# Altium schematic sheet CONNECTORS2.SchDoc
size A; SheetNumber: 7; SheetTotal: 8
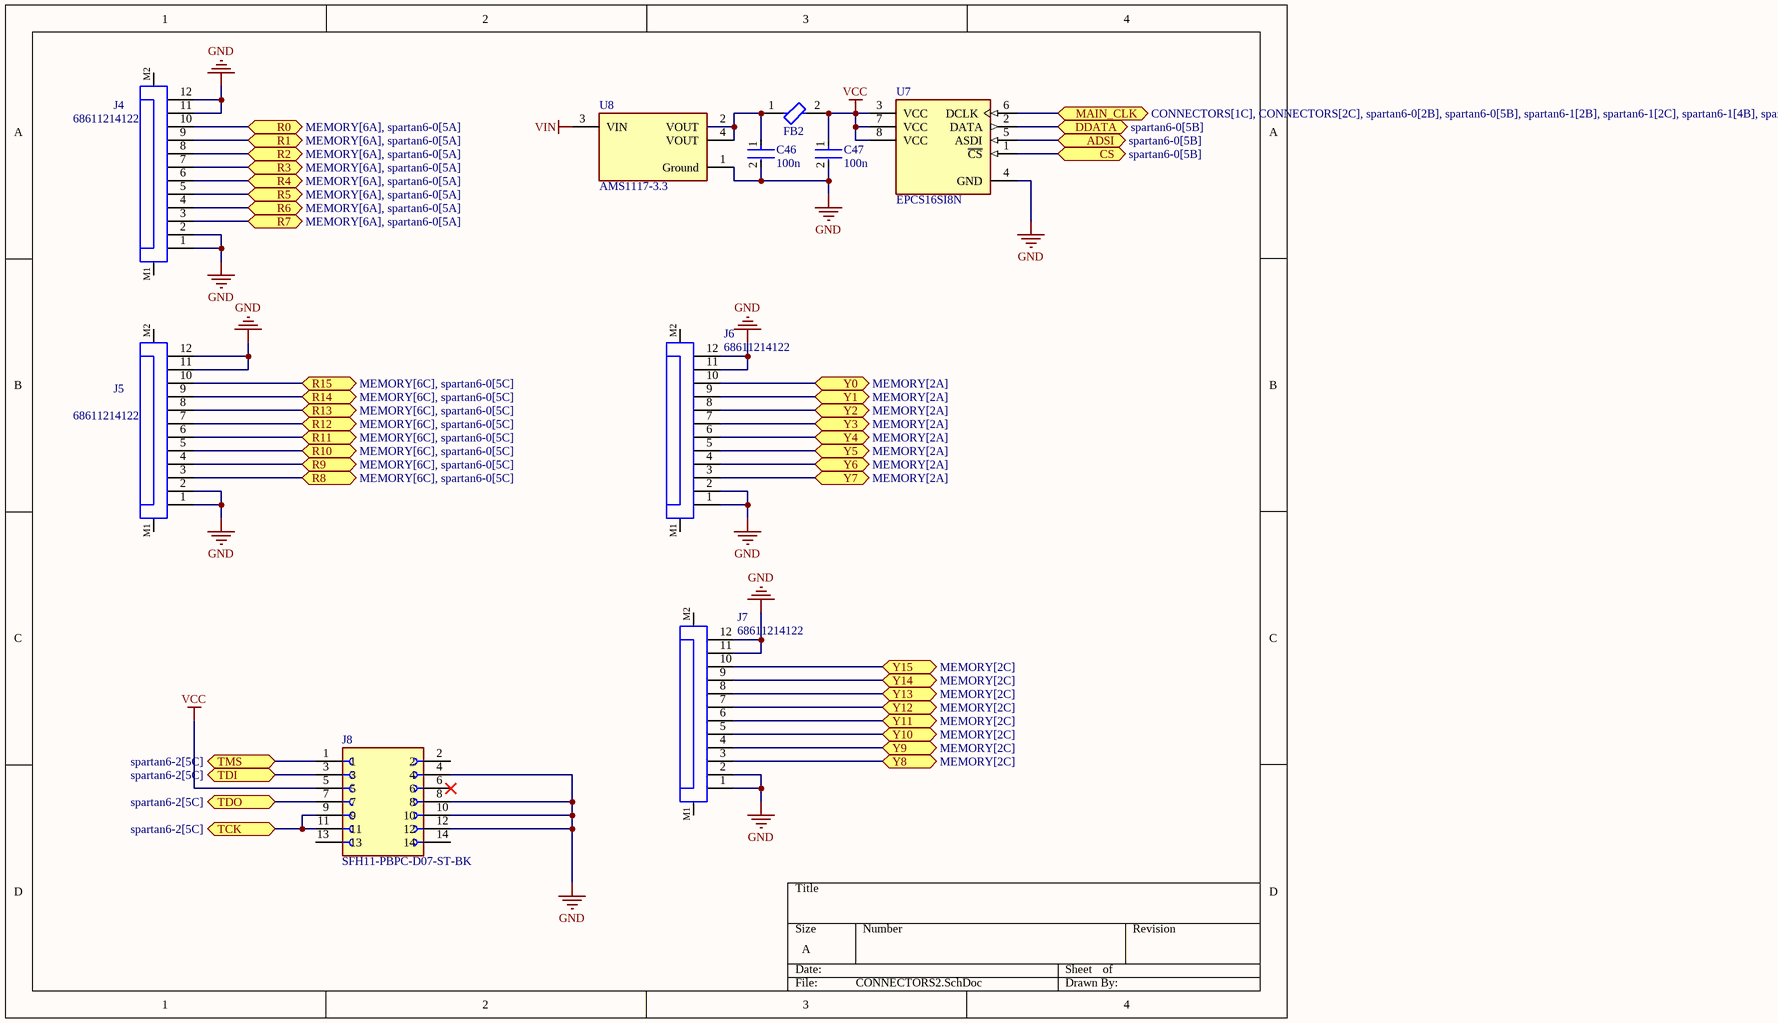
[diagram p0: CONNECTORS2.SchDoc]

## Parts
C46  100n  [FP-CL10-IPC_C]
C47  100n  [FP-CL10-IPC_C]
FB2  BLM18KG121TN1D  [FP-BLM18-0_15-t0_6-d1_2-IPC_A]  (value not drawn)
J4  68611214122  [68611214122]
J5  68611214122  [68611214122]
J6  68611214122  [68611214122]
J7  68611214122  [68611214122]
J8  SFH11-PBPC-D07-ST-BK  [SULLINS_SFH11-PBPC-D07-ST-BK]
U7  EPCS16SI8N  [FP-SOIC-8-IPC_C]
U8  AMS1117-3.3  [FP-AMS1117-IPC_C]

## Ports
ADSI (bidir, see spartan6-0[5B]), CS (bidir, see spartan6-0[5B]), DDATA (bidir, see spartan6-0[5B]), MAIN_CLK (bidir, see CONNECTORS[1C], CONNECTORS[2C], spartan6-0[2B], spartan6-0[5B], spartan6-1[2B], spartan6-1[2C], spartan6-1[4B], spartan6-2[3D]), R0 (bidir, see MEMORY[6A], spartan6-0[5A]), R1 (bidir, see MEMORY[6A], spartan6-0[5A]), R2 (bidir, see MEMORY[6A], spartan6-0[5A]), R3 (bidir, see MEMORY[6A], spartan6-0[5A]), R4 (bidir, see MEMORY[6A], spartan6-0[5A]), R5 (bidir, see MEMORY[6A], spartan6-0[5A]), R6 (bidir, see MEMORY[6A], spartan6-0[5A]), R7 (bidir, see MEMORY[6A], spartan6-0[5A]), R8 (bidir, see MEMORY[6C], spartan6-0[5C]), R9 (bidir, see MEMORY[6C], spartan6-0[5C]), R10 (bidir, see MEMORY[6C], spartan6-0[5C]), R11 (bidir, see MEMORY[6C], spartan6-0[5C]), R12 (bidir, see MEMORY[6C], spartan6-0[5C]), R13 (bidir, see MEMORY[6C], spartan6-0[5C]), R14 (bidir, see MEMORY[6C], spartan6-0[5C]), R15 (bidir, see MEMORY[6C], spartan6-0[5C]), TCK (bidir, see spartan6-2[5C]), TDI (bidir, see spartan6-2[5C]), TDO (bidir, see spartan6-2[5C]), TMS (bidir, see spartan6-2[5C]), Y0 (bidir, see MEMORY[2A]), Y1 (bidir, see MEMORY[2A]), Y2 (bidir, see MEMORY[2A]), Y3 (bidir, see MEMORY[2A]), Y4 (bidir, see MEMORY[2A]), Y5 (bidir, see MEMORY[2A]), Y6 (bidir, see MEMORY[2A]), Y7 (bidir, see MEMORY[2A]), Y8 (bidir, see MEMORY[2C]), Y9 (bidir, see MEMORY[2C]), Y10 (bidir, see MEMORY[2C]), Y11 (bidir, see MEMORY[2C]), Y12 (bidir, see MEMORY[2C]), Y13 (bidir, see MEMORY[2C]), Y14 (bidir, see MEMORY[2C]), Y15 (bidir, see MEMORY[2C])

## Nets
GND: C46.2 C47.2 J4.1 J4.2 J4.11 J4.12 J5.1 J5.2 J5.11 J5.12 J6.1 J6.2 J6.11 J6.12 J7.1 J7.2 J7.11 J7.12 J8.4 J8.8 J8.10 J8.12 U7.4(GND) U8.1(Ground)
VCC: C47.1 FB2.2 J8.5 U7.3(VCC) U7.7(VCC) U7.8(VCC)
VIN: U8.3(VIN)
ADSI: U7.5(ASDI) ; port ADSI
CS: U7.1(~{CS}) ; port CS
DDATA: U7.2(DATA) ; port DDATA
MAIN_CLK: U7.6(DCLK) ; port MAIN_CLK
R0: J4.10 ; port R0
R1: J4.9 ; port R1
R2: J4.8 ; port R2
R3: J4.7 ; port R3
R4: J4.6 ; port R4
R5: J4.5 ; port R5
R6: J4.4 ; port R6
R7: J4.3 ; port R7
R8: J5.3 ; port R8
R9: J5.4 ; port R9
R10: J5.5 ; port R10
R11: J5.6 ; port R11
R12: J5.7 ; port R12
R13: J5.8 ; port R13
R14: J5.9 ; port R14
R15: J5.10 ; port R15
TCK: J8.9 J8.11 ; port TCK
TDI: J8.3 ; port TDI
TDO: J8.7 ; port TDO
TMS: J8.1 ; port TMS
Y0: J6.10 ; port Y0
Y1: J6.9 ; port Y1
Y2: J6.8 ; port Y2
Y3: J6.7 ; port Y3
Y4: J6.6 ; port Y4
Y5: J6.5 ; port Y5
Y6: J6.4 ; port Y6
Y7: J6.3 ; port Y7
Y8: J7.3 ; port Y8
Y9: J7.4 ; port Y9
Y10: J7.5 ; port Y10
Y11: J7.6 ; port Y11
Y12: J7.7 ; port Y12
Y13: J7.8 ; port Y13
Y14: J7.9 ; port Y14
Y15: J7.10 ; port Y15
NetC46_1: C46.1 FB2.1 U8.2(VOUT) U8.4(VOUT)

Not connected (* = marked no-connect by the designer): J4 M1 M2; J5 M1 M2; J6 M1 M2; J7 M1 M2; J8 2 6* 13 14

## Library data of the parts
C46 C47 = CMP-13271-003017-1: Cap Ceramic 4.7uF 10V X5R ±10% Pad SMD 0603 +85°C T/R; Capacitance: 4.7uF; Case/Package: 0603; Packaging: Tape and Reel; Width: 0.031inch; Contact Plating: Tin; Thickness: 0.035inch; Package Quantity: 1; Voltage Rating: 10V; Case Code (Metric): 1608; Case Code (Imperial): 0603; Depth: 0.8mm; Height: 0.8mm; Tolerance: 10%; Max Operating Temperature: 85°C; Length: 1.6mm; Dielectric: X5R; Mount: Surface Mount; Radiation Hardening: No; Min Operating Temperature: -55°C
FB2 = CMP-0686-00554-8: FERRITE BEAD 120 OHM 0603 1LN; Max Current Rating: 3A; DC Resistance (DCR): 30mR; Impedance: 120R; Number of Lines: 1; Test Frequency: 100MHz; Tolerance: 25%; Package Quantity: 4000; Min Operating Temperature: -55°C; Termination: SMD/SMT; REACH SVHC: No SVHC; Core Material: Ferrite; Material: Ferrite; Current Rating: 3A; Height: 0.8mm; Number of Pins: 2; Case/Package: 0603; Case Code (Imperial): 0603; Series: BLM18K; Packaging: Tape and Reel; Inductor Type: FERRITE BEAD; Lead Free: Lead Free; Width: 0.8mm; Case Code (Metric): 1608; Number of Circuits: 1; Max DC Current: 3A; Depth: 0.95mm; Max Operating Temperature: 125°C; Length: 1.6mm; RoHS Compliant: Yes
J4-J7 = CMP-1502-01473-2: NexarPartId: 8917683; Actuator Material: Polyphenylene; Operating Supply Voltage: 125V; Number of Contacts: 12; Contact Resistance: 20mΩ; Gender: Male; Current Rating: 1A; Insulation Resistance: 100MΩ; Pitch: 1mm; Number of Rows: 1; Number of Pins: 12; REACH SVHC: Unknown; Flammability Rating: UL94 V-0; Packaging: Tape and Reel; Voltage Rating: 125V; Contact Plating: Tin; Number of Positions: 12; RoHS: Compliant; Min Operating Temperature: -25°C; Termination: Solder; Contact Material: Bronze, Tin; Lead Pitch: 1mm; Mount: Surface Mount; Width: 2.95mm; Max Operating Temperature: 85°C; Orientation: Horizontal; Length: 19mm; Housing Material: Polyphenylene
J8 = SFH11-PBPC-D07-ST-BK: 14 Position Header Connector Through Hole; MF: Sullins Connector; Value: *; Check_prices: https://www.snapeda.com/parts/SFH11-PBPC-D07-ST-BK/Sullins%20Connector%20Solutions/view-part/851415/?ref=eda; Availability: Warning; Package: None; SnapEDA_Link: https://www.snapeda.com/parts/SFH11-PBPC-D07-ST-BK/Sullins%20Connector%20Solutions/view-part/851415/?ref=snap; Purchase-URL: https://pricing.snapeda.com/search/part/SFH11-PBPC-D07-ST-BK/?ref=eda; Price: None; MP: SFH11-PBPC-D07-ST-BK
U7 = CMP-0215-00002-2: IC CONFIG DEVICE 16MBIT 8SOIC; Manufacturer: Intel; Obsolete Part: true; Interface: Other; Memory Type: FLASH; Nominal Supply Current: 15-20mA; Min Supply Voltage: 2.7V; Memory Size: 16Mbits; Max Junction Temp: +135°C; Standoff Height: 0.1mm; Frequency: 40MHz; Max Supply Voltage: 3.6V; Device Class L1: Integrated Circuits (ICs); Ambient Temperature Range Low: -40°C; Automotive: No; Ipc Land Pattern Name: SOIC127P600X155-8; Lead Free: Yes; Height: 1.75mm; Device Class L3: Flash; Temperature Range High: +135°C; Ambient Temperature Range High: +85°C; Manufacturer Part Number: EPCS16SI8N; ComponentLink2URL: https://www.intel.com/content/dam/www/programmable/us/en/pdfs/literature/hb/cfg/cyc_c51014.pdf; RoHS: TRUE; ComponentLink2Description: Datasheet; Digikey Description: IC CONFIG DEVICE 16MBIT 8SOIC; Octopart: https://octopart.com/epcs16si8n-intel-80907697; Package: SOIC-8; Temperature: to +135°C; Device Class L2: Memory; Footprint Url: https://www.intel.com/content/dam/www/programmable/us/en/pdfs/literature/packaging/04r00424-00.pdf; Category: IC; Mouser Description: FPGA - Configuration Memory IC - Ser. Config Mem Flash 16Mb 40 MHz
U8 = CMP-209535-000001-1: LDO Voltage Regulators 1A, 3.3V; Manufacturer: Advanced Monolithic Systems; Dropout Voltage: 1.1V; Output Type: Fixed; Nominal Supply Current: 5mA; Max Power Dissipation: 1.2W; Max Supply Voltage: 15V; Number Of Outputs: 1; Standoff Height: 0.64mm; Max Junction Temp: +125°C; Height: 1.8mm; Package: AMS1117; Device Class L2: Power Management ICs; ComponentLink2Description: Datasheet; ComponentLink2URL: http://www.advanced-monolithic.com/pdf/ds1117.pdf; Category: IC; RoHS: TRUE; Automotive: No; Device Class L1: Integrated Circuits (ICs); Output Current: 1A; Device Class L3: Voltage Regulators - Linear; Temperature: -40°C to +125°C; Output Voltage: 3.3V; Manufacturer Part Number: AMS1117-3.3; Temperature Range Low: -40°C; Octopart: https://octopart.com/ams1117-3.3-advanced+monolithic+systems-25899300; Lead Free: Yes; Ipc Land Pattern Name: SOT229P700X180-4; Temperature Range High: +125°C